# EAGLE design nycrsign (EAGLE 6.1)
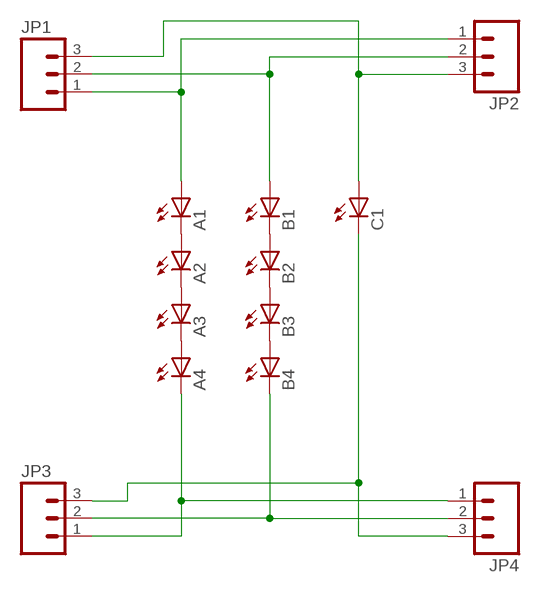
[diagram p0: schematic, sheet 1]

## Parts
A1  LED5MM  [LED5MM]
A2  LED5MM  [LED5MM]
A3  LED5MM  [LED5MM]
A4  LED5MM  [LED5MM]
B1  LED5MM  [LED5MM]
B2  LED5MM  [LED5MM]
B3  LED5MM  [LED5MM]
B4  LED5MM  [LED5MM]
C1  LED5MM  [LED5MM]
JP1  M03LONGPADS  [1X03_LONGPADS]
JP2  M03LONGPADS  [1X03_LONGPADS]
JP3  M03LONGPADS  [1X03_LONGPADS]
JP4  M03LONGPADS  [1X03_LONGPADS]

## Nets
A4: A4.K(C) JP3.1 JP4.1
N$1: A1.K(C) A2.A
N$2: A2.K(C) A3.A
N$3: A3.K(C) A4.A
N$4: B1.K(C) B2.A
N$5: B2.K(C) B3.A
N$6: B3.K(C) B4.A
N$7: A1.A JP1.1 JP2.1
N$8: B1.A JP1.2 JP2.2
N$9: C1.A JP1.3 JP2.3
N$13: B4.K(C) JP3.2 JP4.2
N$14: C1.K(C) JP3.3 JP4.3

## Library data of the parts
A1-A4 B1-B4 C1 = led:LED: LED OSRAM: - CHIPLED LG R971, LG N971, LY N971, LG Q971, LY Q971, LO R971, LY R971 LH N974, LH R974 LS Q976, LO Q976, LY Q976 LO Q996 - Hyper CHIPLED LW Q18S LB Q993, LB Q99A, LB R99A - SideLED LS A670, LO A670, LY A670, LG A670, LP A670 LB A673, LV A673, LT A673, LW A673 LH A674 LY A675 LS A676, LA A676, LO A676, LY A676, LW A676 LS A679, LY A679, LG A679 - Hyper Micro SIDELED® LS Y876, LA Y876, LO Y876, LY Y876 LT Y87S - SmartLED LW L88C, LW L88S LB L89C, LB L89S, LG L890 LS L89K, LO L89K, LY L89K LS L896, LA L896, LO L896, LY L896 - TOPLED LS T670, LO T670, LY T670, LG T670, LP T670 LSG T670, LSP T670, LSY T670, LOP T670, LYG T670 LG T671, LOG T671, LSG T671 LB T673, LV T673, LT T673, LW T673 LH T674 LS T676, LA T676, LO T676, LY T676, LB T676, LH T676, LSB T676, LW T676 LB T67C, LV T67C, LT T67C, LS T67K, LO T67K, LY T67K, LW E67C LS E67B, LA E67B, LO E67B, LY E67B, LB E67C, LV E67C, LT E67C LW T67C LS T679, LY T679, LG T679 LS T770, LO T770, LY T770, LG T770, LP T770 LB T773, LV T773, LT T773, LW T773 LH T774 LS E675, LA E675, LY E675, LS T675 LS T776, LA T776, LO T776, LY T776, LB T776 LHGB T686 LT T68C, LB T68C - Hyper Mini TOPLED® LB M676 - Mini TOPLED Santana® LG M470 LS M47K, LO M47K, LY M47K Source: http://www.osram.convergy.de LUXEON: - LUMILED® LXK2-PW12-R00, LXK2-PW12-S00, LXK2-PW14-U00, LXK2-PW14-V00 LXK2-PM12-R00, LXK2-PM12-S00, LXK2-PM14-U00 LXK2-PE12-Q00, LXK2-PE12-R00, LXK2-PE12-S00, LXK2-PE14-T00, LXK2-PE14-U00 LXK2-PB12-K00, LXK2-PB12-L00, LXK2-PB12-M00, LXK2-PB14-N00, LXK2-PB14-P00, LXK2-PB14-Q00 LXK2-PR12-L00, LXK2-PR12-M00, LXK2-PR14-Q00, LXK2-PR14-R00 LXK2-PD12-Q00, LXK2-PD12-R00, LXK2-PD12-S00 LXK2-PH12-R00, LXK2-PH12-S00 LXK2-PL12-P00, LXK2-PL12-Q00, LXK2-PL12-R00 Source: www.luxeon.com KINGBRIGHT: KA-3528ASYC Source: www.kingbright.com
JP1-JP4 = SparkFun:M03: Header 3 Standard 3-pin 0.1" header. Use with straight break away headers (SKU : PRT-00116), right angle break away headers (PRT-00553), swiss pins (PRT-00743), machine pins (PRT-00117), and female headers (PRT-00115). Molex polarized connector foot print use with SKU : PRT-08232 with associated crimp pins and housings.

## Net classes
0 default: width 1.016 mm, drill 0.508 mm, clearance 0.508 mm

## Board
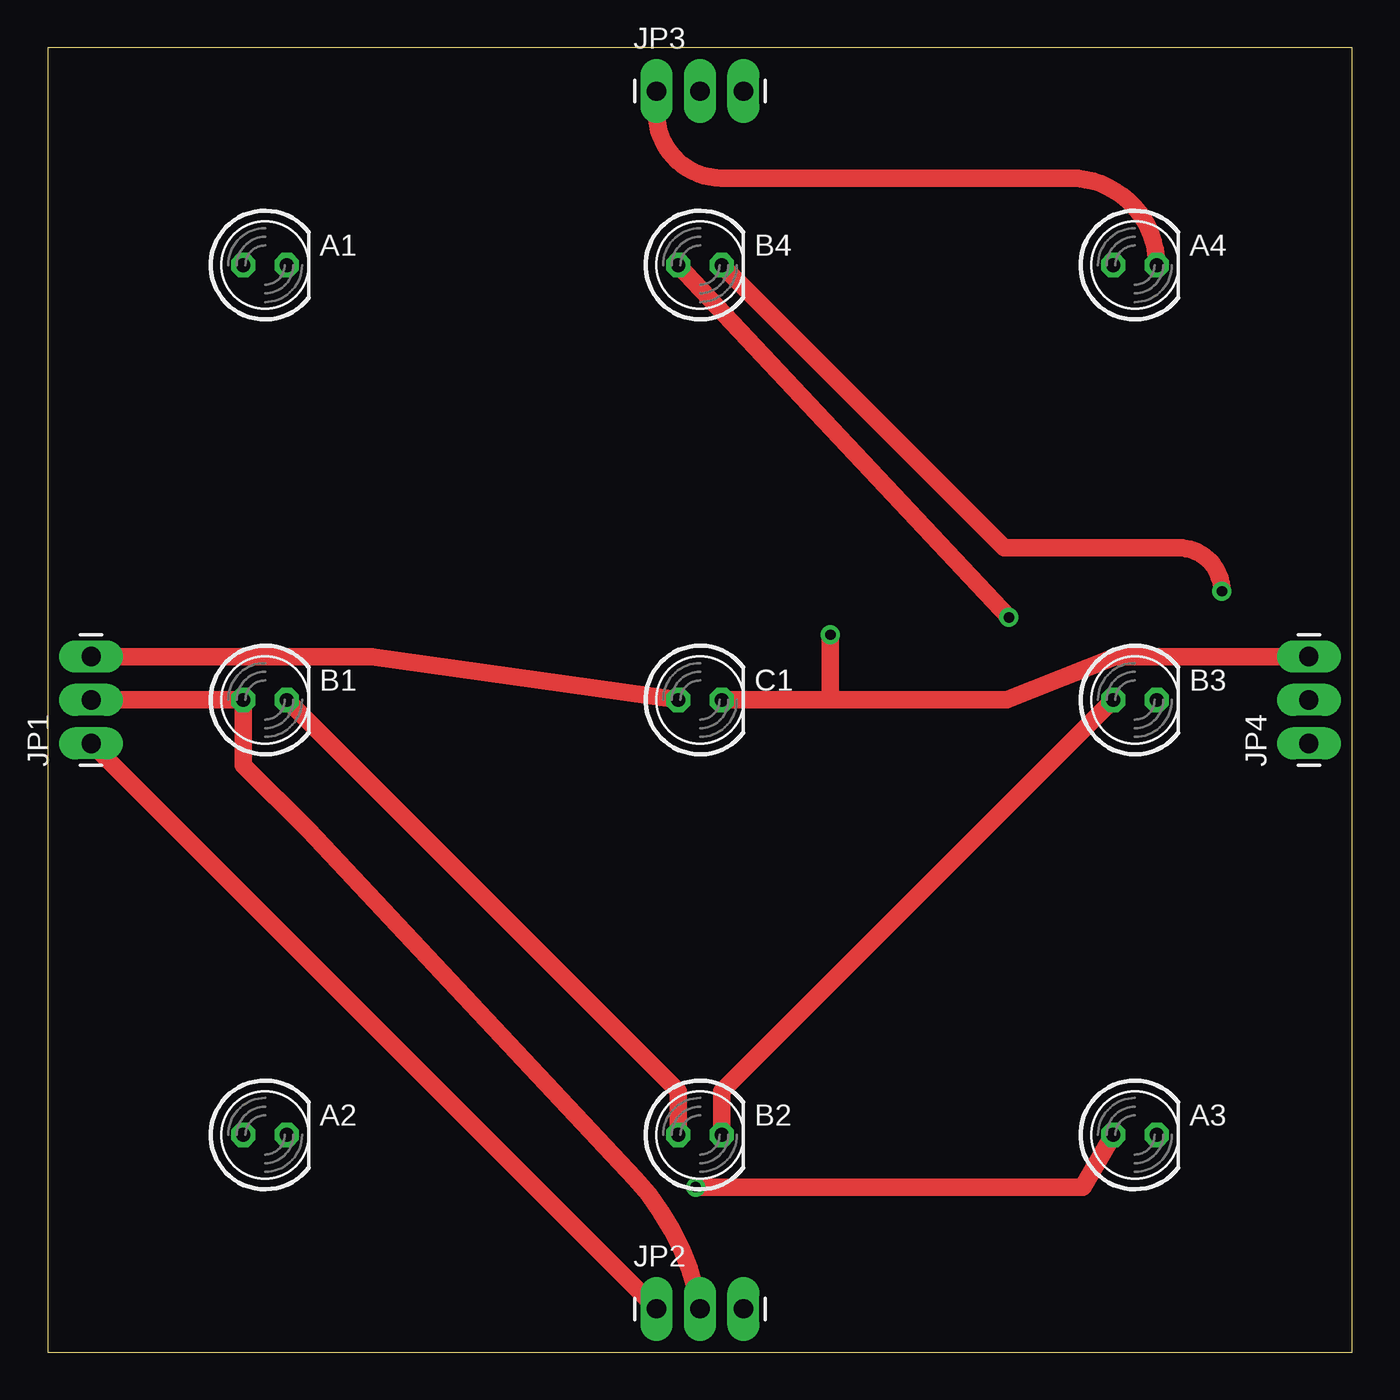
[diagram p1: board, top side]
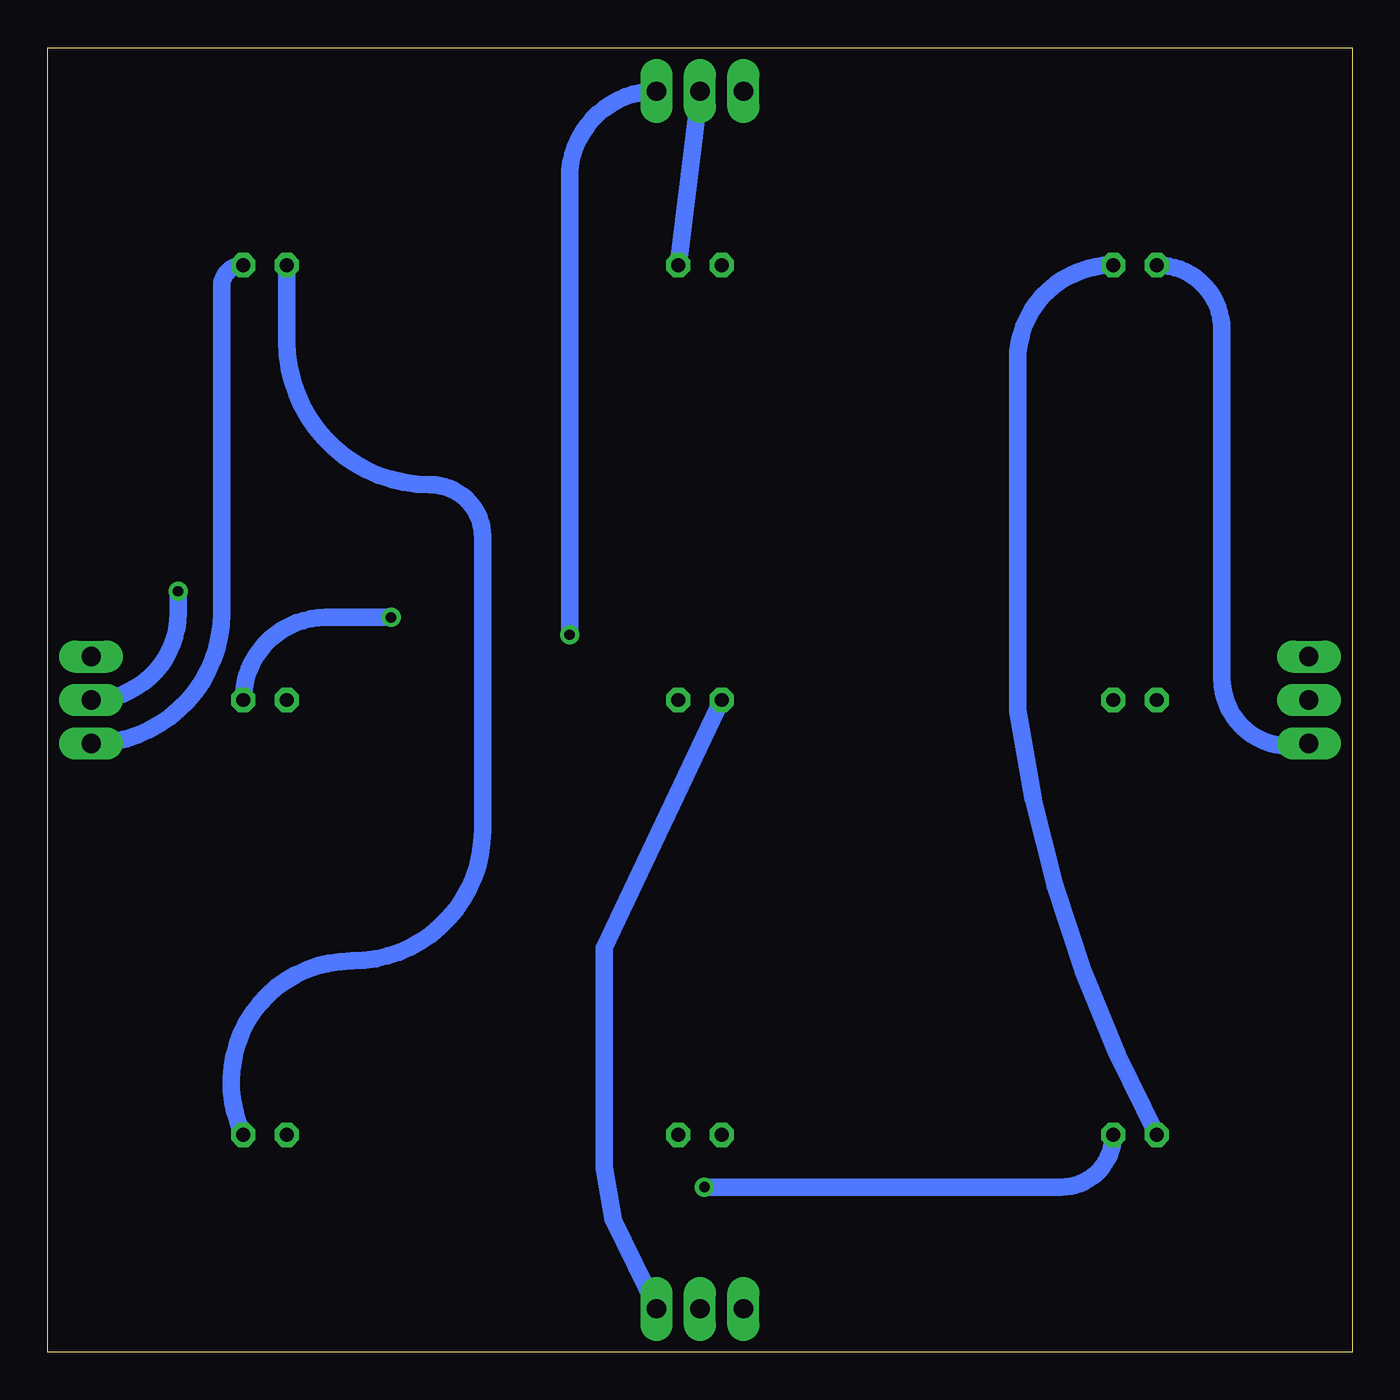
[diagram p2: board, bottom side, seen from below]

Size 76.2 x 76.2 mm. Coordinates in mm from the lower left corner, seen from the top.
Outline: 0,0 76.2,0 76.2,76.2 0,76.2 0,0
Copper layers (1*16): Top 0.035mm / dielectric 1.5mm / Bottom 0.035mm
Design rules: minimum track width 8mil, minimum drill 20mil, track to track 8mil, track to pad 8mil, pad to pad 8mil, via to via 8mil, smd to smd 8mil, copper to edge 10mil, drill to drill 8mil, minimum pad ring 12mil, minimum via ring 10mil, stop-mask expansion 4mil, vias tented up to drill 25mil, thermal gap 10mil

### Footprints (pad centres in the part's own frame; a part is rotated, then mirrored left to right if it is on the bottom)
LED5MM = drill 0.813 octagon: A -1.27,0; K 1.27,0
1X03_LONGPADS = drill 1.118 pad 1.88 long: 1 0,0; 2 2.54,0; 3 5.08,0

### Placement (x,y rotation side)
A1  12.7,63.5 0 top
A2  12.7,12.7 0 top
A3  63.5,12.7 0 top
A4  63.5,63.5 0 top
B1  12.7,38.1 0 top
B2  38.1,12.7 0 top
B3  63.5,38.1 0 top
B4  38.1,63.5 0 top
C1  38.1,38.1 0 top
JP1  2.54,35.56 90 top
JP2  35.56,2.54 0 top
JP3  35.56,73.66 0 top
JP4  73.66,35.56 90 top

### Tracks (layer width: path | path; a pad name or v marks a point on that pad's centre or on a via)
A4
  Top 1.016: JP3.1 35.56,72.39 arc90 39.37,68.58 59.69,68.58 arc-90 A4.K
  Bottom 1.016: JP4.1 arc-90 66.04,43.18 66.04,62.23 arc90 A4.K
N$1
  Bottom 1.016: A2.A arc20 19.56,37.47 19.56,57.91 arc90 A1.K
N$2  (via drill 0.61)
  Top 1.016: v37.85,9.65 60.45,9.65 A3.A
  Bottom 1.016: v37.85,9.65 17.02,9.65 arc-90 A2.K
N$3
  Bottom 1.016: A4.A 62.23,59.05 arc-90 53.85,50.67 arc90 50.8,47.62 50.8,30.48 arc90 58.42,22.86 arc-116 A3.K
N$4
  Top 1.016: B2.A 36.83,15.24 B1.K
N$5
  Top 1.016: B2.K 39.37,15.24 B3.A
N$6  (via drill 0.61)
  Top 1.016: v56.13,42.93 B4.A
  Bottom 1.016: v56.13,42.93 59.94,42.93 arc-90 B3.K
N$7
  Top 1.016: JP2.1 JP1.1
  Bottom 1.016: 3.81,35.56 JP1.1 arc106 7.62,39.37 7.62,59.69 arc-90 A1.A
N$8
  Top 1.016: JP1.2 B1.A 11.43,34.29 15.24,30.48 34.29,10.16 arc-33 JP2.2
N$9
  Top 1.016: C1.A 18.92,40.64 JP1.3
  Bottom 1.016: JP2.3 43.18,7.75 43.69,10.79 43.69,23.62 C1.A
N$13  (via drill 0.6)
  Top 1.016: v68.58,44.45 arc90 66.04,46.99 55.88,46.99 B4.K
  Bottom 1.016: JP4.2 arc-90 68.58,43.18 v68.58,44.45 | JP3.2 B4.K
N$14  (via drill 0.6)
  Top 1.016: C1.K 45.72,38.1 | 45.72,38.1 56.01,38.1 62.36,40.64 JP4.3 | 45.72,38.1 v45.72,41.91
  Bottom 1.016: JP3.3 arc-90 45.72,68.58 v45.72,41.91